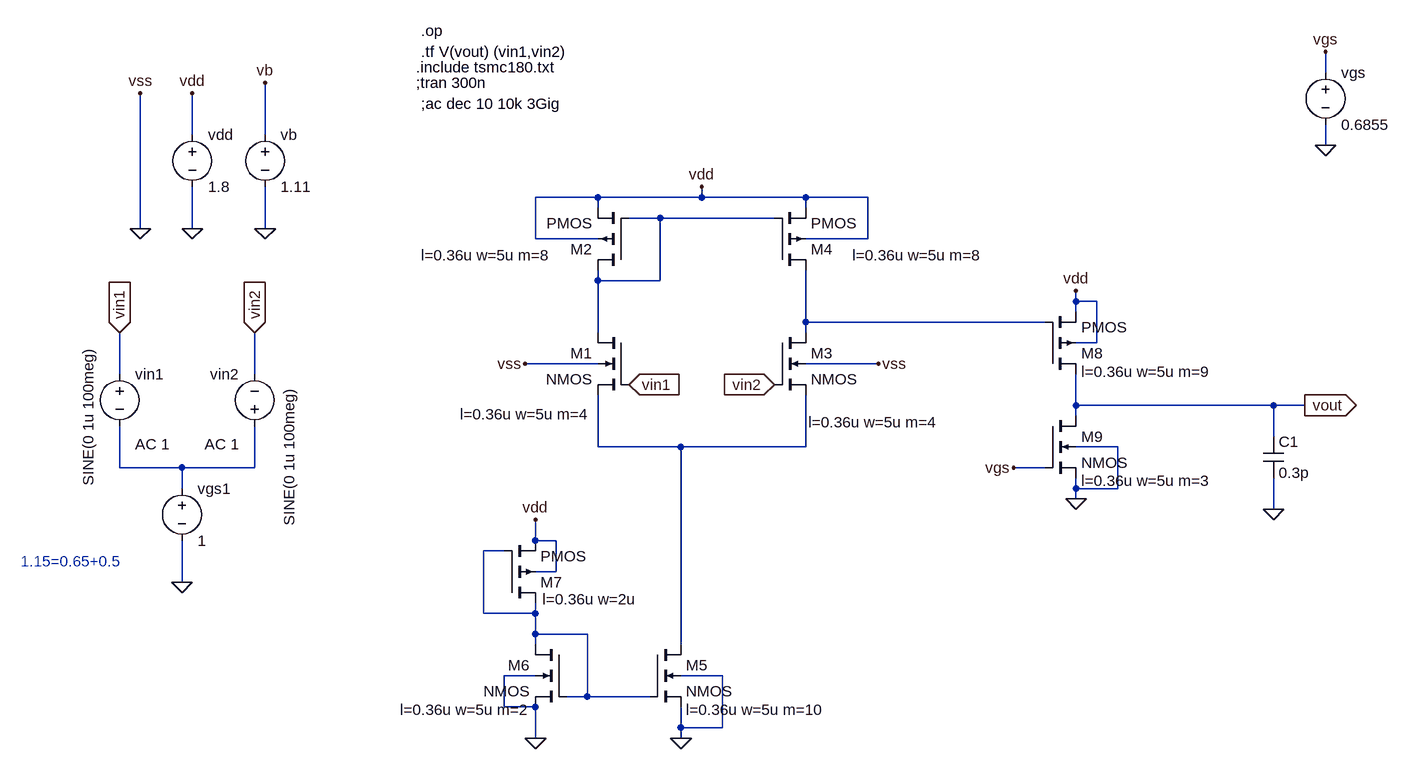
[diagram p0: schematic second stage opamp - 1.asc]
second stage opamp - 1.asc, the LTspice schematic file:
Version 4
SHEET 1 2112 1108
WIRE 1696 64 1696 32
WIRE -48 160 -48 96
WIRE 64 160 64 80
WIRE 1696 176 1696 144
WIRE 576 256 480 256
WIRE 736 256 736 240
WIRE 736 256 576 256
WIRE 896 256 736 256
WIRE 992 256 896 256
WIRE 576 272 576 256
WIRE 896 272 896 256
WIRE 672 288 624 288
WIRE 848 288 672 288
WIRE -128 304 -128 96
WIRE -48 304 -48 240
WIRE 64 304 64 240
WIRE 480 320 480 256
WIRE 576 320 480 320
WIRE 992 320 992 256
WIRE 992 320 896 320
WIRE 576 384 576 368
WIRE 672 384 672 288
WIRE 672 384 576 384
WIRE 1312 416 1312 400
WIRE 1344 416 1312 416
WIRE 1312 432 1312 416
WIRE 896 448 896 368
WIRE 1264 448 896 448
WIRE 576 464 576 384
WIRE 896 464 896 448
WIRE 1344 480 1344 416
WIRE 1344 480 1312 480
WIRE 576 512 464 512
WIRE 1008 512 896 512
WIRE -160 528 -160 464
WIRE 48 528 48 464
WIRE 1312 576 1312 528
WIRE 1616 576 1312 576
WIRE 1664 576 1616 576
WIRE 1312 592 1312 576
WIRE 1616 624 1616 576
WIRE 576 640 576 560
WIRE 704 640 576 640
WIRE 896 640 896 560
WIRE 896 640 704 640
WIRE 1376 640 1312 640
WIRE -160 672 -160 608
WIRE -64 672 -160 672
WIRE 48 672 48 608
WIRE 48 672 -64 672
WIRE 1264 672 1216 672
WIRE -64 704 -64 672
WIRE 1312 704 1312 688
WIRE 1376 704 1376 640
WIRE 1376 704 1312 704
WIRE 1312 720 1312 704
WIRE 1616 736 1616 688
WIRE 480 784 480 752
WIRE 512 784 480 784
WIRE 432 800 400 800
WIRE 512 832 512 784
WIRE 512 832 480 832
WIRE -64 848 -64 784
WIRE 400 896 400 800
WIRE 480 896 480 880
WIRE 480 896 400 896
WIRE 480 928 480 896
WIRE 560 928 480 928
WIRE 480 944 480 928
WIRE 704 944 704 640
WIRE 480 992 432 992
WIRE 768 992 704 992
WIRE 560 1024 560 928
WIRE 560 1024 528 1024
WIRE 656 1024 560 1024
WIRE 432 1040 432 992
WIRE 480 1040 432 1040
WIRE 704 1072 704 1040
WIRE 768 1072 768 992
WIRE 768 1072 704 1072
WIRE 480 1088 480 1040
WIRE 704 1088 704 1072
FLAG 464 512 vss
FLAG 848 544 vin2
IOPIN 848 544 In
FLAG 736 240 vdd
FLAG 1008 512 vss
FLAG 624 544 vin1
IOPIN 624 544 In
FLAG -64 848 0
FLAG -48 304 0
FLAG -128 304 0
FLAG -128 96 vss
FLAG -48 96 vdd
FLAG 64 304 0
FLAG 64 80 vb
FLAG -160 464 vin1
IOPIN -160 464 In
FLAG 48 464 vin2
IOPIN 48 464 In
FLAG 704 1088 0
FLAG 480 1088 0
FLAG 480 752 vdd
FLAG 1312 400 vdd
FLAG 1664 576 vout
IOPIN 1664 576 Out
FLAG 1312 720 0
FLAG 1216 672 vgs
FLAG 1696 176 0
FLAG 1696 32 vgs
FLAG 1616 736 0
DATAFLAG 704 672 ""
DATAFLAG 704 672 ""
DATAFLAG 480 928 ""
DATAFLAG 480 928 ""
DATAFLAG 576 416 ""
DATAFLAG 576 416 ""
DATAFLAG 1312 576 ""
DATAFLAG 1312 576 ""
DATAFLAG 592 1024 ""
DATAFLAG 1008 448 ""
SYMBOL nmos4 624 464 M0
WINDOW 123 60 126 Left 2
SYMATTR Value2 l=0.36u w=5u m=4
SYMATTR InstName M1
SYMBOL pmos4 624 368 R180
WINDOW 123 120 23 Left 2
SYMATTR Value2 l=0.36u w=5u m=8
SYMATTR InstName M2
SYMBOL nmos4 848 464 R0
WINDOW 123 52 138 Left 2
SYMATTR Value2 l=0.36u w=5u m=4
SYMATTR InstName M3
SYMBOL pmos4 848 368 M180
WINDOW 123 120 23 Left 2
SYMATTR Value2 l=0.36u w=5u m=8
SYMATTR InstName M4
SYMBOL voltage -64 688 R0
WINDOW 123 0 0 Left 0
WINDOW 39 0 0 Left 0
SYMATTR InstName vgs1
SYMATTR Value 1
SYMBOL voltage -160 512 R0
WINDOW 3 -48 -25 VRight 2
WINDOW 123 24 124 Left 2
WINDOW 39 0 0 Left 0
SYMATTR Value SINE(0 1u 100meg)
SYMATTR Value2 AC 1
SYMATTR InstName vin1
SYMBOL voltage 48 624 R180
WINDOW 0 24 96 Left 2
WINDOW 3 -53 -138 VRight 2
WINDOW 123 24 -12 Left 2
WINDOW 39 0 0 Left 0
SYMATTR InstName vin2
SYMATTR Value SINE(0 1u 100meg)
SYMATTR Value2 AC 1
SYMBOL voltage -48 144 R0
WINDOW 123 0 0 Left 0
WINDOW 39 0 0 Left 0
SYMATTR InstName vdd
SYMATTR Value 1.8
SYMBOL voltage 64 144 R0
WINDOW 123 0 0 Left 0
WINDOW 39 0 0 Left 0
SYMATTR InstName vb
SYMATTR Value 1.11
SYMBOL nmos4 528 944 M0
WINDOW 123 56 100 Left 2
SYMATTR Value2 l=0.36u w=5u m=2
SYMATTR InstName M6
SYMBOL pmos4 432 880 M180
WINDOW 123 59 6 Left 2
SYMATTR Value2 l=0.36u w=2u
SYMATTR InstName M7
SYMBOL nmos4 656 944 R0
WINDOW 123 56 100 Left 2
SYMATTR Value2 l=0.36u w=5u m=10
SYMATTR InstName M5
SYMBOL pmos4 1264 528 M180
WINDOW 123 56 4 Left 2
SYMATTR Value2 l=0.36u w=5u m=9
SYMATTR InstName M8
SYMBOL nmos4 1264 592 R0
WINDOW 123 56 100 Left 2
SYMATTR Value2 l=0.36u w=5u m=3
SYMATTR InstName M9
SYMBOL voltage 1696 48 R0
WINDOW 123 0 0 Left 0
WINDOW 39 0 0 Left 0
SYMATTR InstName vgs
SYMATTR Value 0.6855
SYMBOL cap 1600 624 R0
SYMATTR InstName C1
SYMATTR Value 0.3p
TEXT 296 56 Left 2 !.include tsmc180.txt
TEXT 304 0 Left 2 !.op
TEXT 296 80 Left 2 !;tran 300n
TEXT 304 112 Left 2 !;ac dec 10 10k 3Gig
TEXT 304 32 Left 2 !.tf V(vout) (vin1,vin2)
TEXT -312 816 Left 2 ;1.15=0.65+0.5

The netlist it stands for:
* second stage opamp - 1.asc
M1 N001 vin1 N003 0 NMOS l=0.36u w=5u m=4
M2 N001 N001 vdd vdd PMOS l=0.36u w=5u m=8
M3 N002 vin2 N003 0 NMOS l=0.36u w=5u m=4
M4 N002 N001 vdd vdd PMOS l=0.36u w=5u m=8
vgs1 N004 0 1
vin1 vin1 N004 SINE(0 1u 100meg) AC 1
vin2 N004 vin2 SINE(0 1u 100meg) AC 1
vdd vdd 0 1.8
vb vb 0 1.11
M6 N005 N005 0 0 NMOS l=0.36u w=5u m=2
M7 N005 N005 vdd vdd PMOS l=0.36u w=2u
M5 N003 N005 0 0 NMOS l=0.36u w=5u m=10
M8 vout N002 vdd vdd PMOS l=0.36u w=5u m=9
M9 vout vgs 0 0 NMOS l=0.36u w=5u m=3
vgs vgs 0 0.6855
C1 vout 0 0.3p
.model NMOS NMOS
.model PMOS PMOS
.lib standard.mos
.include tsmc180.txt
.op
;tran 300n
;ac dec 10 10k 3Gig
.tf V(vout) (vin1,vin2)
* 1.15=0.65+0.5
.backanno
.end